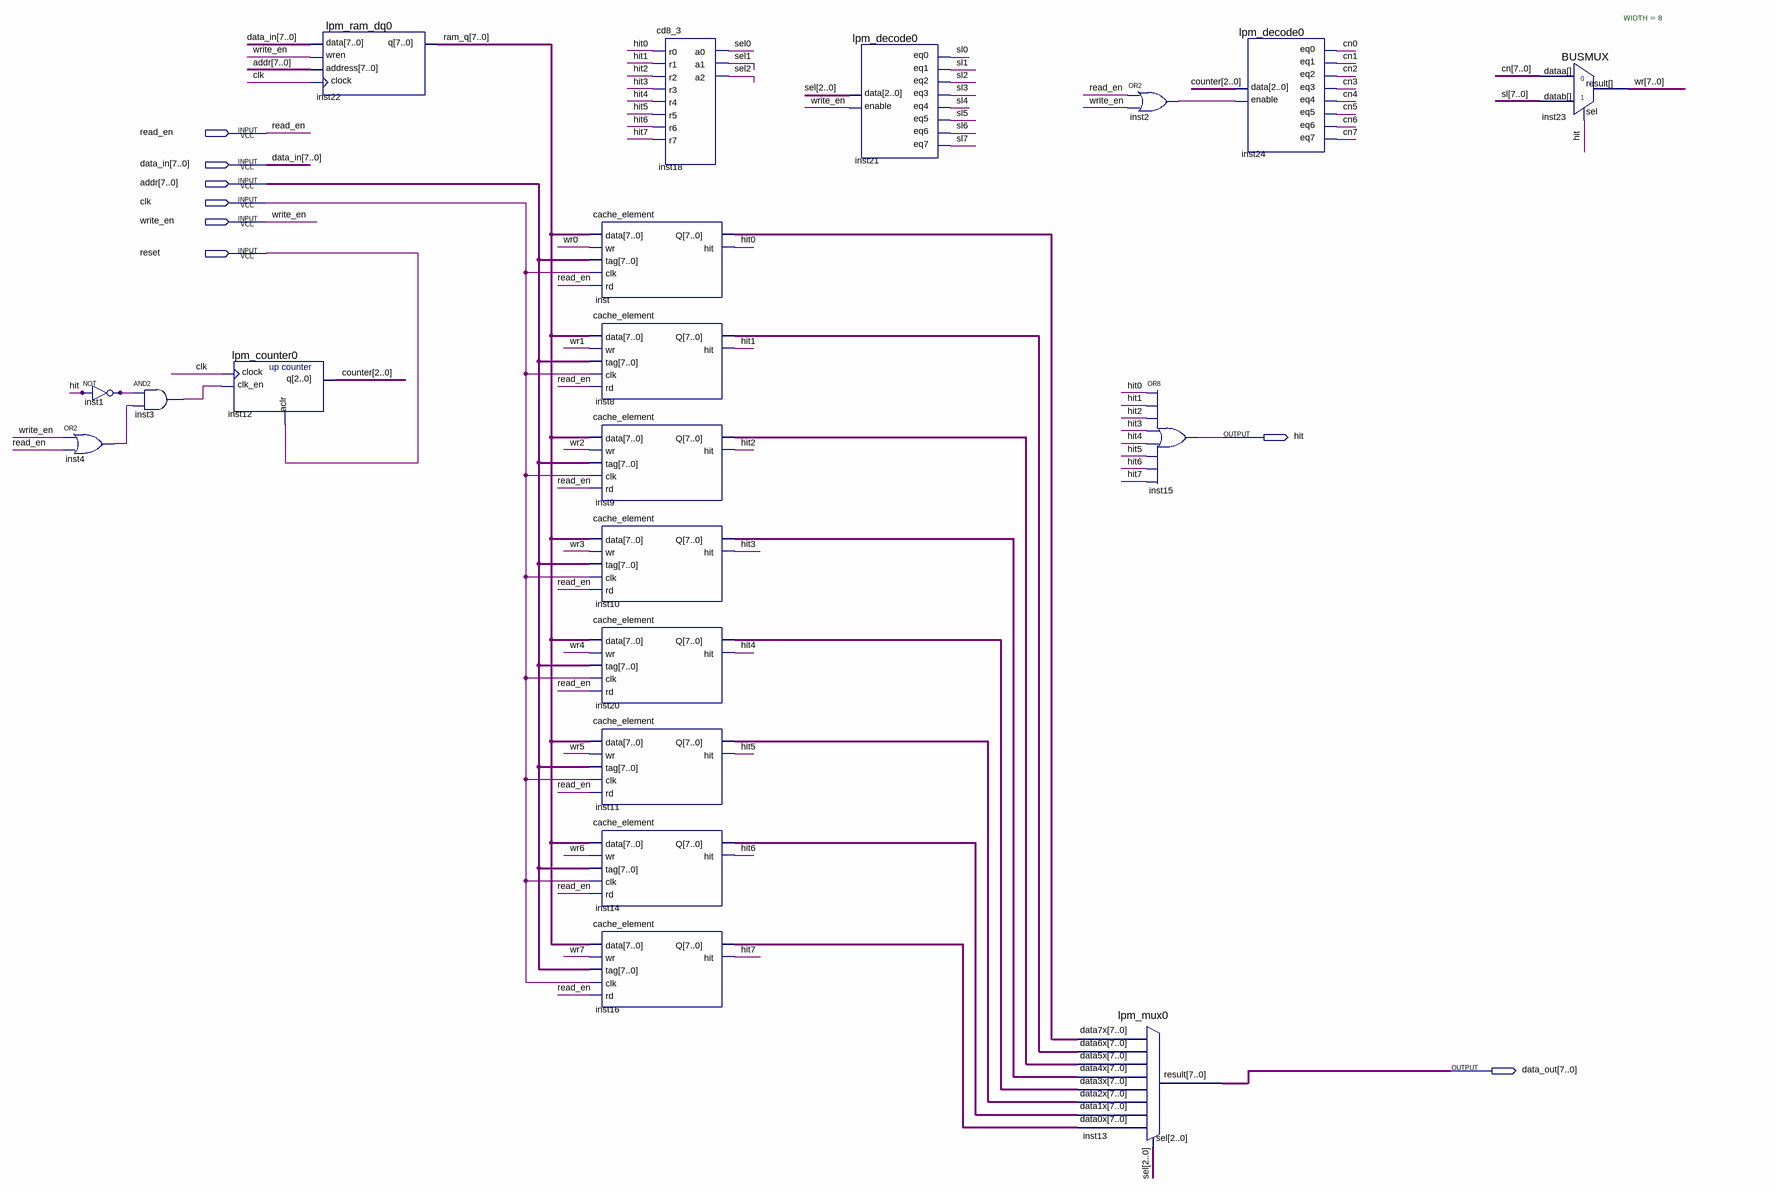
[diagram p0: schematic sheet]
// Quartus schematic cache.bdf as structural Verilog: 20 symbols, 8 pins
module cache (
  input  read_en,
  input  [7:0] data_in,
  input  [7:0] addr,
  input  clk,
  input  write_en,
  input  reset,
  output hit,
  output [7:0] data_out
);

  wire hit0, hit1, hit2, hit3, hit4, hit5, hit6, hit7, inst1_out, inst2_out, inst3_out, inst4_out;
  wire [2:0] counter, sel;
  wire [7:0] cn, inst8_q, inst9_q, inst10_q, inst11_q, inst14_q, inst16_q, inst20_q, inst_q, ram_q, sl, wr;

  or inst4 (inst4_out, write_en, read_en);
  not inst1 (inst1_out, hit);
  and inst3 (inst3_out, inst1_out, inst4_out);
  lpm_counter0 inst12 (.clock(clk), .clk_en(inst3_out), .aclr(reset), .q(counter));
  lpm_ram_dq0 inst22 (.data(data_in), .wren(write_en), .address(addr), .clock(clk), .q(ram_q));
  cache_element inst (.data(ram_q), .wr(wr[0]), .tag(addr), .clk(clk), .rd(read_en), .Q(inst_q), .hit(hit0));
  cache_element inst8 (.data(ram_q), .wr(wr[1]), .tag(addr), .clk(clk), .rd(read_en), .Q(inst8_q), .hit(hit1));
  cache_element inst9 (.data(ram_q), .wr(wr[2]), .tag(addr), .clk(clk), .rd(read_en), .Q(inst9_q), .hit(hit2));
  cache_element inst10 (.data(ram_q), .wr(wr[3]), .tag(addr), .clk(clk), .rd(read_en), .Q(inst10_q), .hit(hit3));
  cache_element inst20 (.data(ram_q), .wr(wr[4]), .tag(addr), .clk(clk), .rd(read_en), .Q(inst20_q), .hit(hit4));
  cache_element inst11 (.data(ram_q), .wr(wr[5]), .tag(addr), .clk(clk), .rd(read_en), .Q(inst11_q), .hit(hit5));
  cache_element inst14 (.data(ram_q), .wr(wr[6]), .tag(addr), .clk(clk), .rd(read_en), .Q(inst14_q), .hit(hit6));
  cache_element inst16 (.data(ram_q), .wr(wr[7]), .tag(addr), .clk(clk), .rd(read_en), .Q(inst16_q), .hit(hit7));
  cd8_3 inst18 (
    .r0(hit0), .r1(hit1), .r2(hit2), .r3(hit3), .r4(hit4), .r5(hit5), .r6(hit6), .r7(hit7), .a0(sel[0]),
    .a1(sel[1]), .a2(sel[2]));
  lpm_decode0 inst21 (
    .data(sel), .enable(write_en), .eq0(sl[0]), .eq1(sl[1]), .eq2(sl[2]), .eq3(sl[3]), .eq4(sl[4]),
    .eq5(sl[5]), .eq6(sl[6]), .eq7(sl[7]));
  lpm_mux0 inst13 (
    .data7x(inst_q), .data6x(inst8_q), .data5x(inst9_q), .data4x(inst10_q), .data3x(inst20_q),
    .data2x(inst11_q), .data1x(inst14_q), .data0x(inst16_q), .sel(sel), .result(data_out));
  or inst2 (inst2_out, read_en, write_en);
  or inst15 (hit, hit0, hit1, hit2, hit3, hit4, hit5, hit6, hit7);
  lpm_decode0 inst24 (
    .data(counter), .enable(inst2_out), .eq0(cn[0]), .eq1(cn[1]), .eq2(cn[2]), .eq3(cn[3]), .eq4(cn[4]),
    .eq5(cn[5]), .eq6(cn[6]), .eq7(cn[7]));
  BUSMUX #(.WIDTH(8)) inst23 (.datab(sl), .sel(hit), .dataa(cn), .result(wr));
endmodule
